# Altium project DCAR_APDAPTER.PrjPcb
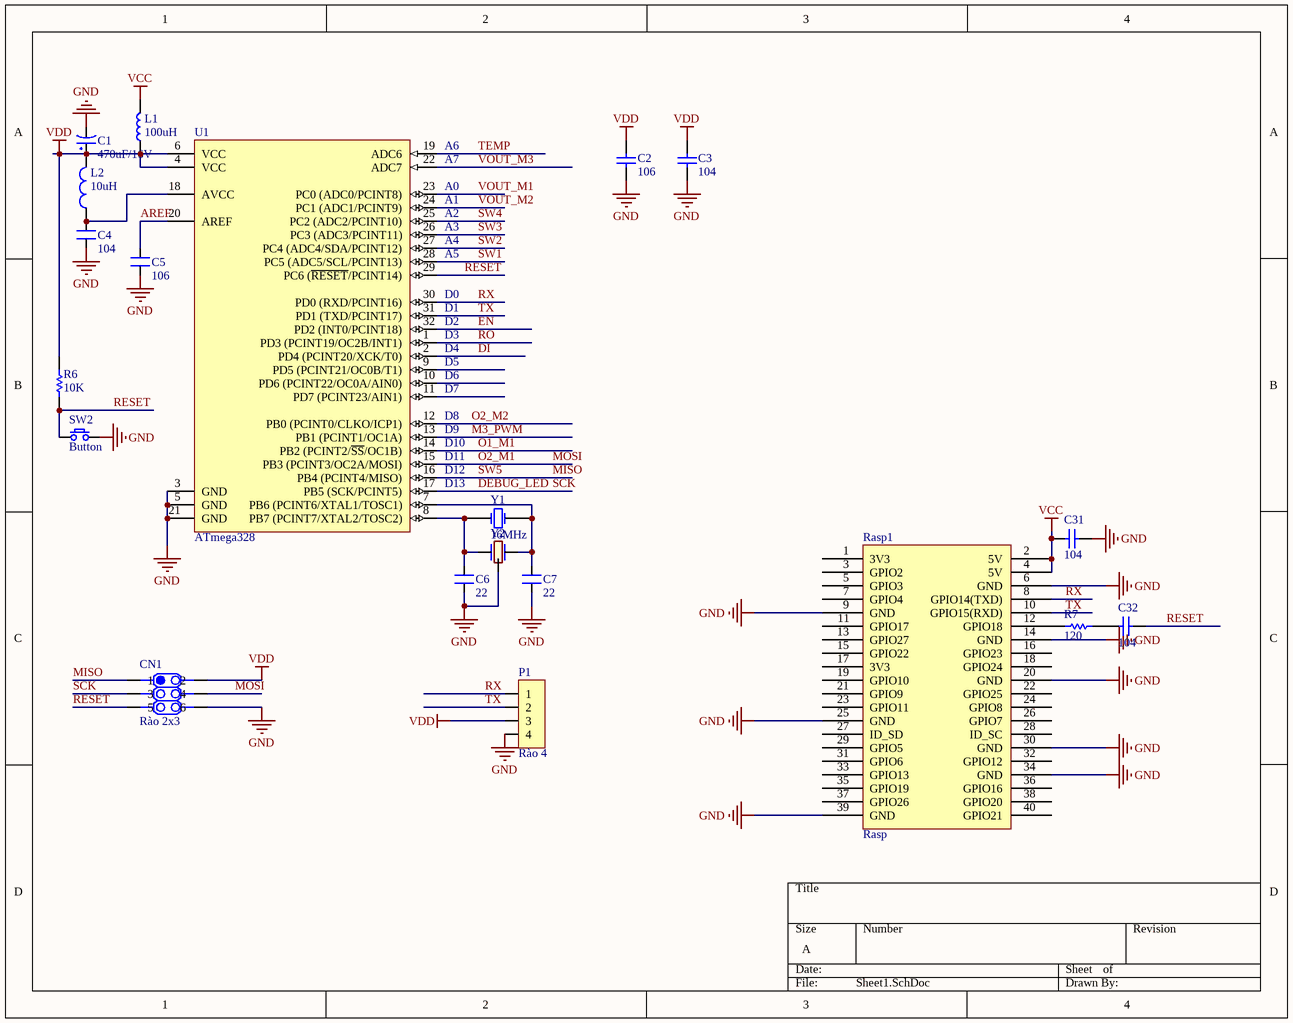
[diagram p0: Sheet1.SchDoc]
3 sheets, 68 parts. Net scope: global (net labels, ports and power ports of the same name join across sheets).
Board file: PCB3.PcbDoc
Sheets:
  Sheet1.SchDoc
  Sheet6.SchDoc
  Sheet7.SchDoc

## Sheet Sheet1.SchDoc
size A

### Parts
C1  470uF/16V  [WCAP-PSHP 8x8.7x3.1]
C2  106  [C 0805 (2012)]
C3  104  [C 0805 (2012)]
C4  104  [R 0805 (2012)]
C5  106  [R 0805 (2012)]
C6  22  [C 0805 (2012)]
C7  22  [C 0805 (2012)]
C31  104  [C 0805 (2012)]
C32  104  [C 0805 (2012)]
CN1  Rào 2x3  [Header 3x2]
L1  100uH  [Inductor SMD 0805 (2012)]
L2  10uH  [R 0805 (2012)]
P1  Rào 4  [Header 4]
R6  10K  [R 0805 (2012)]
R7  120  [R 0805 (2012)]
Rasp1  Rasp  [Raspberry Pi 3B]
SW2  Button  [SW/2/SMD]
U1  ATmega328  [QFP32N]
Y1  16MHz  [XTAL]
Y2  (no value)  [Crystal SMD CSTCE]

### Nets
GND: C1.2 C2.2 C3.2 C4.1 C5.1 C6.1 C7.1 C31.2 CN1.6 P1.4 Rasp1.6(GND) Rasp1.9(GND) Rasp1.14(GND) Rasp1.20(GND) Rasp1.25(GND) Rasp1.30(GND) Rasp1.34(GND) Rasp1.39(GND) SW2.2 U1.3(GND) U1.5(GND) U1.21(GND) Y2.2
VCC: C31.1 L1.2 Rasp1.2(5V) Rasp1.4(5V)
VDD: C1.1 C2.1 C3.1 CN1.2 L1.1 L2.2 P1.3 R6.2 U1.4(VCC) U1.6(VCC)
AREF: C5.2 U1.20(AREF)
DEBUG_LED: CN1.3 U1.17(PB5_(SCK/PCINT5))  [also labelled SCK]
DI: U1.2(PD4_(PCINT20/XCK/T0))
EN: U1.32(PD2_(INT0/PCINT18))
M3_PWM: U1.13(PB1_(PCINT1/OC1A))
MISO: CN1.1 U1.16(PB4_(PCINT4/MISO))  [also labelled SW5]
MOSI: CN1.4 U1.15(PB3_(PCINT3/OC2A/MOSI))  [also labelled O2_M1]
O1_M1: U1.14(PB2_(PCINT2/~{SS}/OC1B))
O2_M2: U1.12(PB0_(PCINT0/CLKO/ICP1))
RESET: C32.2 CN1.5 R6.1 SW2.1 U1.29(PC6_(~{RESET}/PCINT14))
RO: U1.1(PD3_(PCINT19/OC2B/INT1))
RX: P1.1 Rasp1.8(GPIO14(TXD)) U1.30(PD0_(RXD/PCINT16))
SW1: U1.28(PC5_(ADC5/SCL/PCINT13))
SW2: U1.27(PC4_(ADC4/SDA/PCINT12))
SW3: U1.26(PC3_(ADC3/PCINT11))
SW4: U1.25(PC2_(ADC2/PCINT10))
TEMP: U1.19(ADC6)
TX: P1.2 Rasp1.10(GPIO15(RXD)) U1.31(PD1_(TXD/PCINT17))
VOUT_M1: U1.23(PC0_(ADC0/PCINT8))
VOUT_M2: U1.24(PC1_(ADC1/PCINT9))
VOUT_M3: U1.22(ADC7)
NetC4_2: C4.2 L2.1 U1.18(AVCC)
NetC6_2: C6.2 U1.8(PB7_(PCINT7/XTAL2/TOSC2)) Y1.1(OSC1) Y2.3
NetC7_2: C7.2 U1.7(PB6_(PCINT6/XTAL1/TOSC1)) Y1.2(OSC2) Y2.1
NetC32_1: C32.1 R7.1
NetR7_2: R7.2 Rasp1.12(GPIO18)

Not connected (* = marked no-connect by the designer): Rasp1 1(3V3) 3(GPIO2) 5(GPIO3) 7(GPIO4) 11(GPIO17) 13(GPIO27) 15(GPIO22) 16(GPIO23) 17(3V3) 18(GPIO24) 19(GPIO10) 21(GPIO9) 22(GPIO25) 23(GPIO11) 24(GPIO8) 26(GPIO7) 27(ID_SD) 28(ID_SC) 29(GPIO5) 31(GPIO6) 32(GPIO12) 33(GPIO13) 35(GPIO19) 36(GPIO16) 37(GPIO26) 38(GPIO20) 40(GPIO21); U1 9(PD5_(PCINT21/OC0B/T1)) 10(PD6_(PCINT22/OC0A/AIN0)) 11(PD7_(PCINT23/AIN1))

### Notes on the sheet
- (near U1) A6
- (near U1) A7
- (near U1) A0
- (near U1) A1
- (near U1) A2
- (near U1) A3
- (near U1) A4
- (near U1) A5
- (near U1) D0
- (near U1) D2
- (near U1) D3
- (near U1) D4
- (near U1) D5
- (near U1) D1
- (near U1) D7
- (near U1) D8
- (near U1) D9
- (near U1) D6
- (near U1) D10
- (near U1) D11
- D12
- D13

### Library data of the parts
C1 = CP4: Cap 1000uF/16V - 220uF/50V; Description 5: 4,7uF>10uF/250V_3,3uF>10uF/400V - 2,2uF>4,7uF/450V; Description 1: 2200uF-3300uF/6,3V - 1000uF-2200uF/10V; Description 2: 1000uF/16V - 470uF => 1000uF/25V - 100uF/100V; Description 3: 330uF>470uF/35V_220uF>470uF/50V_10uF>22uF/250V; Description 4: 220uF => 330uF/63V - 10uF =>33uF/160 - 200V; Value: 1000uF/16V
C2 C3 C31 C32 = Capacitor NP: Capacitor non-pol
C4 C6 C7 = CN2: Cap np 104 => 105pF; Value: 0.1uF
C5 = CN1: Cap np  1pF - 472pF; Value: 100pF
CN1 = CON.HDR2x3: Header 2x3; Publisher: Hoang Nguyen; ComponentLink1Description: Digikey Part link; ComponentLink2Description: Open DataSheet; ComponentLink2URL: H:\LIBRARY\LIBRARY.Datasheet\
L1 = Inductor
L2 = L1: Inductor; Value: 150 mH
P1 = Header 4: Header, 4-Pin
R6 R7 = Resistor: Published: 8-Jun-2000; LatestRevisionDate: 17-Jul-2002; LatestRevisionNote: Re-released for DXP Platform.; PackageReference: AXIAL-0.3; Publisher: Altium Limited
  R6: Value: 10K
SW2 = SW SPST: Tact switch 2 pin
U1 = ATmega328-AU: 8-bit AVR Microcontroller, 32KB Flash, 1KB EEPROM, 2KB SRAM, 32-pin TQFP, Industrial Grade (-40°C to 85°C); Published: 1-Apr-2010; DatasheetVersion: revA, Jan-2010; PackageVersion: revB, Oct-2001; PackageReference: 32A; Publisher: Altium Limited; PackageDescription: 32-Lead, 7x7x1.0 mm Body, 0.8mm Lead Pitch, Thin Profile Plastic Quad Flat Package (TQFP); Supplier 1: Digi-Key; Supplier Part Number 1: ATMEGA328-AU-ND; Supplier 2: Mouser; Supplier Part Number 2: 556-ATMEGA328-AU; Code_JEDEC: MS-026-ABA; ComponentLink1Description: Manufacturer Link; ComponentLink1URL: http://www.atmel.com/products/avr/default.asp?; ComponentLink2Description: ATmega48A/48PA/88A/88PA/168A/168PA/328/328P Datasheet; ComponentLink2URL: http://www.atmel.com/dyn/resources/prod_documents/8271.pdf; ComponentLink3Description: ATmega48A/48PA/88A/88PA/168A/168PA/328/328P Summary; ComponentLink3URL: http://www.atmel.com/dyn/resources/prod_documents/8271S.pdf; ComponentLink4Description: Atmel.com Home; ComponentLink4URL: http://www.atmel.com
Y1 = XTAL: Crystal Oscillator; Published: 8-Jun-2000; LatestRevisionDate: 17-Jul-2002; LatestRevisionNote: Re-released for DXP Platform.; PackageReference: R38; Publisher: Altium Limited
Y2 = Crystal CSTCE

## Sheet Sheet6.SchDoc
size A
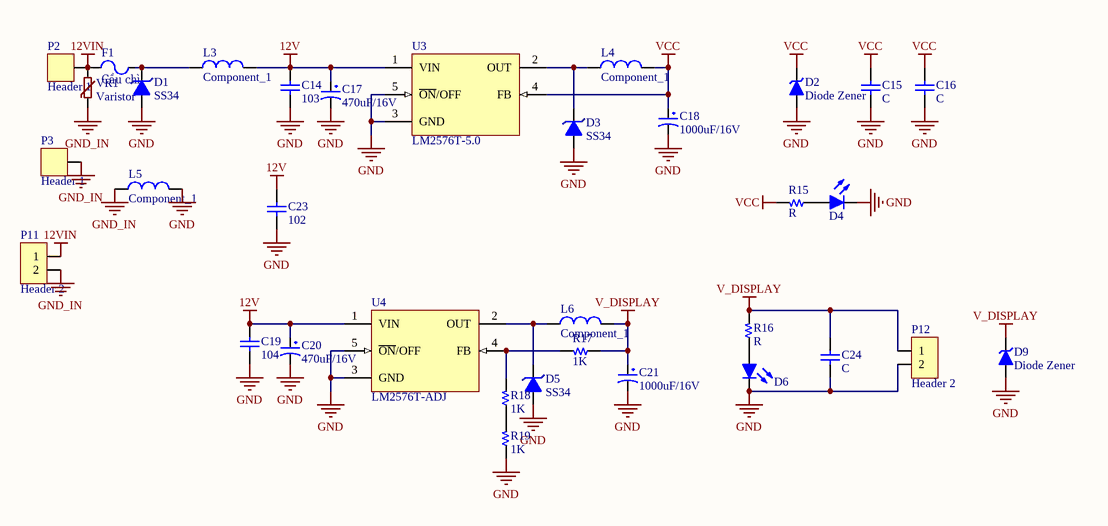
[diagram p1: Sheet6.SchDoc]

### Parts
C14  103  [C 0805]
C15  C  [C 0805]
C16  C  [C 0805]
C17  470uF/16V  [WCAP-PSHP 8x8.7x3.1]
C18  1000uF/16V  [WCAP-PSHP 8x8.7x3.1]
C19  104  [C 0805]
C20  470uF/16V  [WCAP-PSHP 8x8.7x3.1]
C21  1000uF/16V  [WCAP-PSHP 8x8.7x3.1]
C23  102  [C 0805]
C24  C  [C 0805]
D1  SS34  [DO-214AC (SMA)]
D2  Diode Zener  [SOD-80]
D3  SS34  [DO-214AC (SMA)]
D4  Led  [Led 0805 Blue]  (value not drawn)
D5  SS34  [DO-214AC (SMA)]
D6  Led  [Led 0805 Blue]  (value not drawn)
D9  Diode Zener  [SOD-80]
F1  Cầu chì  [DCAR Fuse holder]
L3  Component_1  [1210]
L4  Component_1  [1210]
L5  Component_1  [1210]
L6  Component_1  [1210]
P2  Header 1  [HDR/Terminal/1/copper/8.8]
P3  Header 1  [HDR/Terminal/1/copper/8.8]
P11  Header 2  [HDR Domino 2]
P12  Header 2  [CON Header 2]
R15  R  [R 0805]
R16  R  [R 0805]
R17  1K  [R 0805]
R18  1K  [R 0805]
R19  1K  [R 0805]
U3  LM2576T-5.0  [D2-PACK5]
U4  LM2576T-ADJ  [D2-PACK5]
VR1  Varistor  [VARISTOR DISC 5MM/7MM]

### Nets
12V: C14.1 C17.1 C19.1 C20.1 C23.1 L3.2 U3.1(VIN) U4.1(VIN)
12VIN: F1.1 P2.1 P11.1 VR1.1
GND: C14.2 C15.2 C16.2 C17.2 C18.2 C19.2 C20.2 C21.2 C23.2 C24.2 D1.1(A) D2.1(A) D3.1(A) D4.2(K) D5.1(A) D6.2(K) D9.1(A) L5.2 P12.2 R19.1 U3.3(GND) U3.5(~{ON}/OFF) U4.3(GND) U4.5(~{ON}/OFF)
GND_IN: L5.1 P3.1 P11.2 VR1.2
V_DISPLAY: C21.1 C24.1 D9.2(K) L6.2 P12.1 R16.2 R17.1
VCC: C15.1 C16.1 C18.1 D2.2(K) L4.2 R15.2 U3.4(FB)
NetD1_2: D1.2(K) F1.2 L3.1
NetD3_2: D3.2(K) L4.1 U3.2(OUT)
NetD4_1: D4.1(A) R15.1
NetD5_2: D5.2(K) L6.1 U4.2(OUT)
NetD6_1: D6.1(A) R16.1
NetR17_2: R17.2 R18.2 U4.4(FB)
NetR18_1: R18.1 R19.2

### Library data of the parts
C14-C16 C19 C23 C24 = Capacitor NP: Capacitor non-pol
C17 C20 = CP3: Cap 100uF/35V - 470uF/16V; Value: 100uF/35V/50V; Description 1: 1000uF/6,3V - 470uF/16V - 330uF - 25V; Description 2: 220uF/35V - 100uF/50V - 63V - 4,7uF/200V; Description 3: 22uF => 33uF100V - 3,3uF => 4,7uF/250V; Description 4: 2,2uF =>3,3uF/350 - 2,2uF/400V - 1uF/450V
C18 C21 = CP4: as C1 on sheet Sheet1; Value: 1000uF/16V
D1 D3 D5 = Zener
D2 D9 = Diode Zener: Zener Diode; Published: 8-Jun-2000; LatestRevisionDate: 17-Jul-2002; LatestRevisionNote: Re-released for DXP Platform.; PackageReference: DIODE-0.7; Publisher: Altium Limited
D4 D6 = Led: Typical LED
F1 = Fuse
P2 P3 = Header 1: Header, 1-Pin
P11 P12 = Header 2: Header, 2-Pin; LatestRevisionDate: 17-Jul-2002; LatestRevisionNote: Re-released for DXP Platform.; Publisher: Altium Limited
R15-R19 = Resistor
U3 U4 = LM2576T-5.0: SIMPLE SWITCHER; 3A Step-Down Voltage Regulator; Manufacturer: National Semiconductor; PackageTopMarking: NSUZXYTT*LM2576T*-5.0 P+; PowerWise: N; FirstPublished: 4-Dec-2008; DatasheetVersion: Aug-2004; PackageVersion: revJ, Jan-1992; PackageReference: T05A; Publisher: Altium Limited; PackageDescription: TO-220, Molded, 5 Lead, Straight; CompType: Switcher; PartNumber: LM2576T-5.0; RoHS: O; PinCount: 5; DigiKeyPartNumber: LM2576T-5.0-ND; Code_JEDEC: TO-220-AB; ComponentLink1Description: LM2576 Datasheet; ComponentLink1URL: http://www.national.com/ds/LM/LM2576.pdf; ComponentLink2Description: LM2576 Web Page; ComponentLink2URL: http://www.national.com/pf/LM/LM2576.html; ComponentLink3Description: T05A Package Page; ComponentLink3URL: http://www.national.com/packaging/folders/t05a.html

## Sheet Sheet7.SchDoc
size A
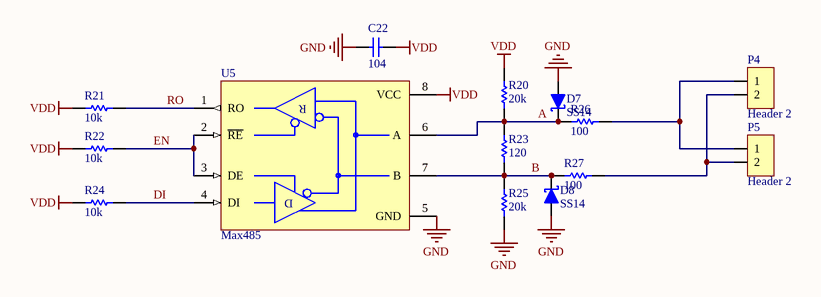
[diagram p2: Sheet7.SchDoc]

### Parts
C22  104  [C 0805 (2012)]
D7  SS14  [DO-214AC (SMA)]
D8  SS14  [DO-214AC (SMA)]
P4  Header 2  [HDR Domino 2]
P5  Header 2  [HDR Domino 2]
R20  20k  [R 0805 (2012)]
R21  10k  [R 0805 (2012)]
R22  10k  [R 0805 (2012)]
R23  120  [R 0805 (2012)]
R24  10k  [R 0805 (2012)]
R25  20k  [R 0805 (2012)]
R26  100  [R 0805 (2012)]
R27  100  [R 0805 (2012)]
U5  Max485  [SOIC-8]

### Nets
GND: C22.2 D7.1(A) D8.1(A) R25.1 U5.5(GND)
VDD: C22.1 R20.2 R21.2 R22.2 R24.2 U5.8(VCC)
A: D7.2(K) R20.1 R23.2 R26.2 U5.6(A)
B: D8.2(K) R23.1 R25.2 R27.2 U5.7(B)
DI: R24.1 U5.4(DI)
EN: R22.1 U5.2(~{RE}) U5.3(DE)
RO: R21.1 U5.1(RO)
NetP4_1: P4.1 P5.1 R26.1
NetP4_2: P4.2 P5.2 R27.1

### Notes on the sheet
- (in symbol MAX485) R; D

### Library data of the parts
C22 = Capacitor NP: Capacitor non-pol
D7 D8 = Diode Schottky: Schottky Diode; Published: 8-Jun-2000; LatestRevisionDate: 17-Jul-2002; LatestRevisionNote: Re-released for DXP Platform.; PackageReference: SMB; Publisher: Altium Limited; Code_JEDEC: DO-214-AA
P4 P5 = Header 2: Header, 2-Pin; LatestRevisionDate: 17-Jul-2002; LatestRevisionNote: Re-released for DXP Platform.; Publisher: Altium Limited
R20-R27 = Resistor: Published: 8-Jun-2000; LatestRevisionDate: 17-Jul-2002; LatestRevisionNote: Re-released for DXP Platform.; PackageReference: AXIAL-0.3; Publisher: Altium Limited

## Nets that join several sheets
GND: Sheet1 (23 pins), Sheet6 (24 pins), Sheet7 (5 pins)
VCC: Sheet1 (C31.1 L1.2 Rasp1.2 Rasp1.4), Sheet6 (7 pins)
VDD: Sheet1 (10 pins), Sheet7 (6 pins)
DI: Sheet1 (U1.2), Sheet7 (R24.1 U5.4)
EN: Sheet1 (U1.32), Sheet7 (R22.1 U5.2 U5.3)
RO: Sheet1 (U1.1), Sheet7 (R21.1 U5.1)